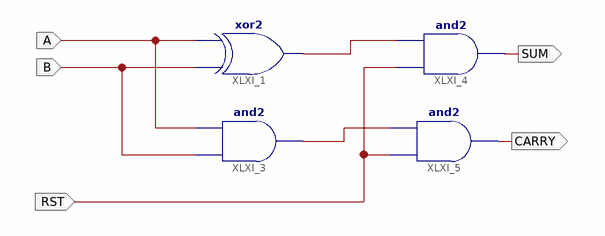
[diagram p0: schematic sheet 1]
// Xilinx ISE schematic Half_Adder.sch (spartan6) as structural Verilog: 4 symbols, 5 ports
module Half_Adder (
  input  A,
  input  B,
  input  RST,
  output SUM,
  output CARRY
);

  wire XLXN_1, XLXN_2;

  xor XLXI_1 (XLXN_1, B, A);
  and XLXI_3 (XLXN_2, B, A);
  and XLXI_4 (SUM, RST, XLXN_1);
  and XLXI_5 (CARRY, RST, XLXN_2);
endmodule
